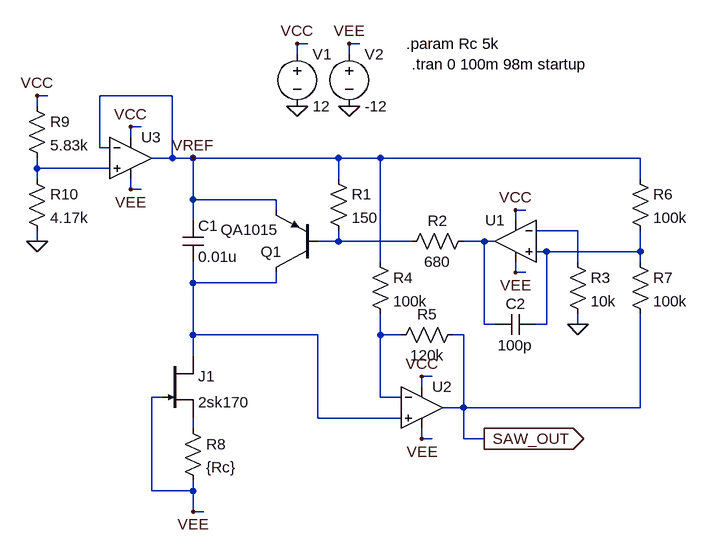
[diagram p0: schematic VCO_Sawtooth_2_JFET_CurrentSourece_BufferdVref.asc]
VCO_Sawtooth_2_JFET_CurrentSourece_BufferdVref.asc, the LTspice schematic file:
Version 4
SHEET 1 996 680
WIRE 288 -192 272 -192
WIRE 368 -192 352 -192
WIRE 272 -176 272 -192
WIRE 352 -176 352 -192
WIRE -112 -112 -128 -112
WIRE 80 -112 -32 -112
WIRE -128 -96 -128 -112
WIRE 32 -64 16 -64
WIRE 16 -48 16 -64
WIRE -32 -32 -32 -112
WIRE -16 -32 -32 -32
WIRE 80 -16 80 -112
WIRE 80 -16 48 -16
WIRE 112 -16 80 -16
WIRE 336 -16 112 -16
WIRE 400 -16 336 -16
WIRE 800 -16 400 -16
WIRE -128 0 -128 -16
WIRE -16 0 -128 0
WIRE -128 16 -128 0
WIRE 336 16 336 -16
WIRE 800 16 800 -16
WIRE 16 32 16 16
WIRE 32 32 16 32
WIRE 112 48 112 -16
WIRE 240 48 112 48
WIRE 240 64 240 48
WIRE 624 64 608 64
WIRE 112 80 112 48
WIRE 608 80 608 64
WIRE 704 96 640 96
WIRE -128 112 -128 96
WIRE 336 112 336 96
WIRE 336 112 304 112
WIRE 448 112 336 112
WIRE 560 112 528 112
WIRE 576 112 560 112
WIRE 656 128 640 128
WIRE 800 128 800 96
WIRE 800 128 656 128
WIRE 400 144 400 -16
WIRE 704 144 704 96
WIRE 800 144 800 128
WIRE 608 160 608 144
WIRE 624 160 608 160
WIRE 112 176 112 144
WIRE 240 176 240 160
WIRE 240 176 112 176
WIRE 560 240 560 112
WIRE 576 240 560 240
WIRE 656 240 656 128
WIRE 656 240 640 240
WIRE 704 240 704 224
WIRE 112 256 112 176
WIRE 304 256 112 256
WIRE 400 256 400 224
WIRE 432 256 400 256
WIRE 528 256 512 256
WIRE 112 288 112 256
WIRE 480 320 464 320
WIRE 464 336 464 320
WIRE 64 352 48 352
WIRE 400 352 400 256
WIRE 432 352 400 352
WIRE 528 368 528 256
WIRE 528 368 496 368
WIRE 800 368 800 224
WIRE 800 368 528 368
WIRE 304 384 304 256
WIRE 432 384 304 384
WIRE 112 400 112 384
WIRE 464 416 464 400
WIRE 480 416 464 416
WIRE 528 416 528 368
WIRE 560 416 528 416
WIRE 48 496 48 352
WIRE 112 496 112 480
WIRE 112 496 48 496
WIRE 112 528 112 496
WIRE 128 528 112 528
FLAG 608 64 VCC
FLAG 608 160 VEE
FLAG 704 240 0
FLAG 464 320 VCC
FLAG 464 416 VEE
FLAG 112 -16 VREF
FLAG 272 -96 0
FLAG 352 -96 0
FLAG 272 -192 VCC
FLAG 352 -192 VEE
FLAG 560 416 SAW_OUT
IOPIN 560 416 Out
FLAG 112 528 VEE
FLAG 16 -64 VCC
FLAG 16 32 VEE
FLAG -128 112 0
FLAG -128 -112 VCC
SYMBOL cap 96 80 R0
SYMATTR InstName C1
SYMATTR Value 0.01u
SYMBOL pnp 304 160 R180
WINDOW 3 61 66 Left 2
SYMATTR Value QA1015
SYMATTR InstName Q1
SYMBOL res 320 0 R0
SYMATTR InstName R1
SYMATTR Value 150
SYMBOL res 544 96 R90
WINDOW 0 0 56 VBottom 2
WINDOW 3 32 56 VTop 2
SYMATTR InstName R2
SYMATTR Value 680
SYMBOL Opamps\\UniversalOpamp2 608 112 M0
SYMATTR InstName U1
SYMBOL cap 640 224 R90
WINDOW 0 0 32 VBottom 2
WINDOW 3 32 32 VTop 2
SYMATTR InstName C2
SYMATTR Value 100p
SYMBOL res 688 128 R0
SYMATTR InstName R3
SYMATTR Value 10k
SYMBOL Opamps\\UniversalOpamp2 464 368 R0
SYMATTR InstName U2
SYMBOL res 384 128 R0
SYMATTR InstName R4
SYMATTR Value 100k
SYMBOL res 528 240 R90
WINDOW 0 0 56 VBottom 2
WINDOW 3 32 56 VTop 2
SYMATTR InstName R5
SYMATTR Value 120k
SYMBOL res 784 0 R0
SYMATTR InstName R6
SYMATTR Value 100k
SYMBOL res 784 128 R0
SYMATTR InstName R7
SYMATTR Value 100k
SYMBOL voltage 272 -192 R0
WINDOW 123 0 0 Left 2
WINDOW 39 0 0 Left 2
SYMATTR InstName V1
SYMATTR Value 12
SYMBOL voltage 352 -192 R0
WINDOW 123 0 0 Left 2
WINDOW 39 0 0 Left 2
SYMATTR InstName V2
SYMATTR Value -12
SYMBOL njf 64 288 R0
SYMATTR InstName J1
SYMATTR Value 2sk170
SYMBOL res 96 384 R0
SYMATTR InstName R8
SYMATTR Value {Rc}
SYMBOL Opamps\\UniversalOpamp2 16 -16 R0
SYMATTR InstName U3
SYMBOL res -144 -112 R0
SYMATTR InstName R9
SYMATTR Value 5.83k
SYMBOL res -144 0 R0
SYMATTR InstName R10
SYMATTR Value 4.17k
TEXT 440 -192 Left 2 !.param Rc 5k
TEXT 448 -160 Left 2 !.tran 0 100m 98m startup

The netlist it stands for:
* VCO_Sawtooth_2_JFET_CurrentSourece_BufferdVref.asc
C1 VREF N006 0.01u
Q1 N006 N003 VREF 0 QA1015
R1 VREF N003 150
R2 N004 N003 680
XU1 N005 N002 VCC VEE N004 level.2 Avol=1Meg GBW=10Meg Slew=10Meg ilimit=25m rail=0 Vos=0 phimargin=45 en=0 enk=0 in=0 ink=0 Rin=500Meg  ; pins IN+ IN- V+ V- OUT
C2 N005 N004 100p
R3 N002 0 10k
XU2 N006 N007 VCC VEE SAW_OUT level.2 Avol=1Meg GBW=10Meg Slew=10Meg ilimit=25m rail=0 Vos=0 phimargin=45 en=0 enk=0 in=0 ink=0 Rin=500Meg  ; pins IN+ IN- V+ V- OUT
R4 VREF N007 100k
R5 SAW_OUT N007 120k
R6 VREF N005 100k
R7 N005 SAW_OUT 100k
V1 VCC 0 12
V2 VEE 0 -12
J1 N006 VEE N008 2sk170
R8 N008 VEE {Rc}
XU3 N001 VREF VCC VEE VREF level.2 Avol=1Meg GBW=10Meg Slew=10Meg ilimit=25m rail=0 Vos=0 phimargin=45 en=0 enk=0 in=0 ink=0 Rin=500Meg  ; pins IN+ IN- V+ V- OUT
R9 VCC N001 5.83k
R10 N001 0 4.17k
.model NPN NPN
.model PNP PNP
.lib standard.bjt
.model NJF NJF
.model PJF PJF
.lib standard.jft
.param Rc 5k
.tran 0 100m 98m startup
.lib UniversalOpamps2.sub
.backanno
.end